# EAGLE schematic pic16f1829_for_JRTU-EV17 (EAGLE 9.6.2)
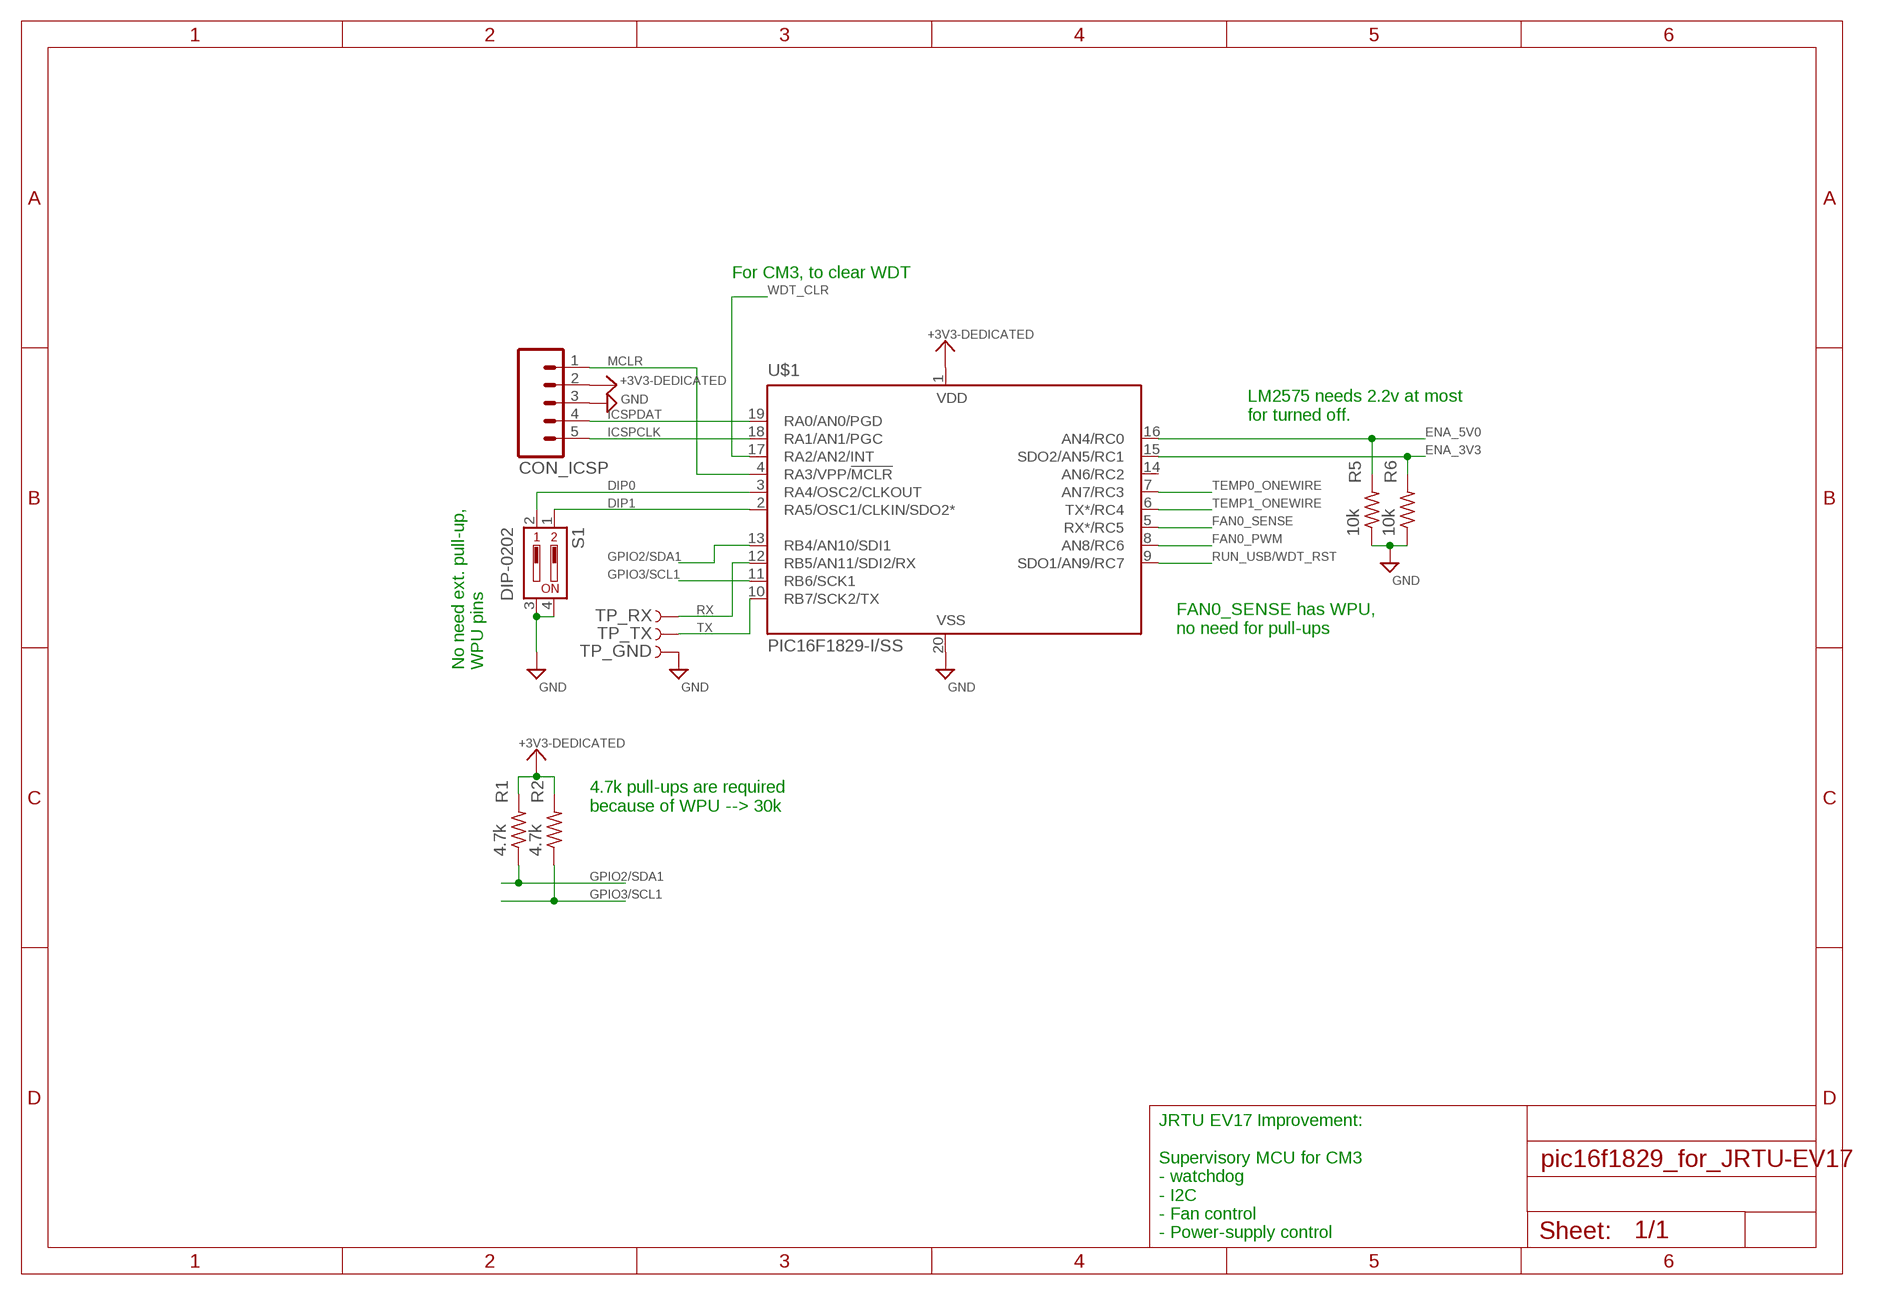
[diagram p0: schematic, sheet 1]

## Parts
CON_ICSP  M05  [1X05]
R1  4.7k  RCL_R-USM0805  [RCL_M0805]
R2  4.7k  RCL_R-USM0805  [RCL_M0805]
R5  10k  RCL_R-USM0805  [RCL_M0805]
R6  10k  RCL_R-USM0805  [RCL_M0805]
S1  DIP-0202  [DIPSWITCH-02]
TP_GND  TEST-POINT3  [PAD.03X.03]
TP_RX  TEST-POINT3  [PAD.03X.03]
TP_TX  TEST-POINT3  [PAD.03X.03]
U$1  PIC16F1829-I/SS  PIC16F1829  [SSOP20]

## Nets
+3V3: CON_ICSP.2 R1.2 R2.2 U$1.1(VDD) ; supply symbol labelled +3V3-DEDICATED
DIP0: S1.2 U$1.3(RA4/OSC2/CLKOUT)
DIP1: S1.1 U$1.2(RA5/OSC1/CLKIN/SDO2*)
ENA_3V3: R6.2 U$1.15(SDO2/AN5/RC1)
ENA_5V0: R5.2 U$1.16(AN4/RC0)
FAN0_PWM: U$1.8(AN8/RC6)
FAN0_SENSE: U$1.5(RX*/RC5)
GND: CON_ICSP.3 R5.1 R6.1 S1.3 S1.4 TP_GND.P$1 U$1.20(VSS)
GPIO2/SDA1: R1.1 U$1.13(RB4/AN10/SDI1)
GPIO3/SCL1: R2.1 U$1.11(RB6/SCK1)
ICSPCLK: CON_ICSP.5 U$1.18(RA1/AN1/PGC)
ICSPDAT: CON_ICSP.4 U$1.19(RA0/AN0/PGD)
MCLR: CON_ICSP.1 U$1.4(RA3/VPP/!MCLR)
RUN_USB/WDT_RST: U$1.9(SDO1/AN9/RC7)
RX: TP_RX.P$1 U$1.12(RB5/AN11/SDI2/RX)
TEMP0_ONEWIRE: U$1.7(AN7/RC3)
TEMP1_ONEWIRE: U$1.6(TX*/RC4)
TX: TP_TX.P$1 U$1.10(RB7/SCK2/TX)
WDT_CLR: U$1.17(RA2/AN2/INT)
Unconnected: U$1.14(AN6/RC2)

## Notes on the sheet
- For CM3, to clear WDT
- LM2575 needs 2.2v at most 
  for turned off.
- FAN0_SENSE has WPU,
  no need for pull-ups
- No need ext. pull-up,
  WPU pins
- 4.7k pull-ups are required
  because of WPU --> 30k
- JRTU EV17 Improvement:
  
  Supervisory MCU for CM3
  - watchdog
  - I2C
  - Fan control
  - Power-supply control

## Library data of the parts
CON_ICSP = ipas:M05: Header 5 Standard 5-pin 0.1" header. Use with straight break away headers (SKU : PRT-00116), right angle break away headers (PRT-00553), swiss pins (PRT-00743), machine pins (PRT-00117), and female headers (PRT-00115).
R1 R2 R5 R6 = ipas:RCL_R-US: RESISTOR, American symbol
S1 = SparkFun-Retired:DIP-02: SMD dip switch 2 positions
TP_GND TP_RX TP_TX = SparkFun-Connectors:TEST-POINT: SparkFun Test Points Bare copper test points for troubleshooting or In-Circuit-Testing. These are used by our Production team for verifying production board runs using pogo-pins on test beds. SparkFun Products: SparkFun LSM9DS1 Breakout <https://www.sparkfun.com/products/13284> SparkFun PSOC <https://www.sparkfun.com/products/13714> SparkFun Load Cell Amplifier <https://www.sparkfun.com/products/13879>
U$1 = SparkFun-IC-Microcontroller:PIC16F1829: PIC16F1829-I/SS SparkFun Products SparkFun Touch Potentiometer <https://www.sparkfun.com/products/13144> (PRT-13144); PROD_ID: IC-12357